# EAGLE design 230v (EAGLE 7.2.0)
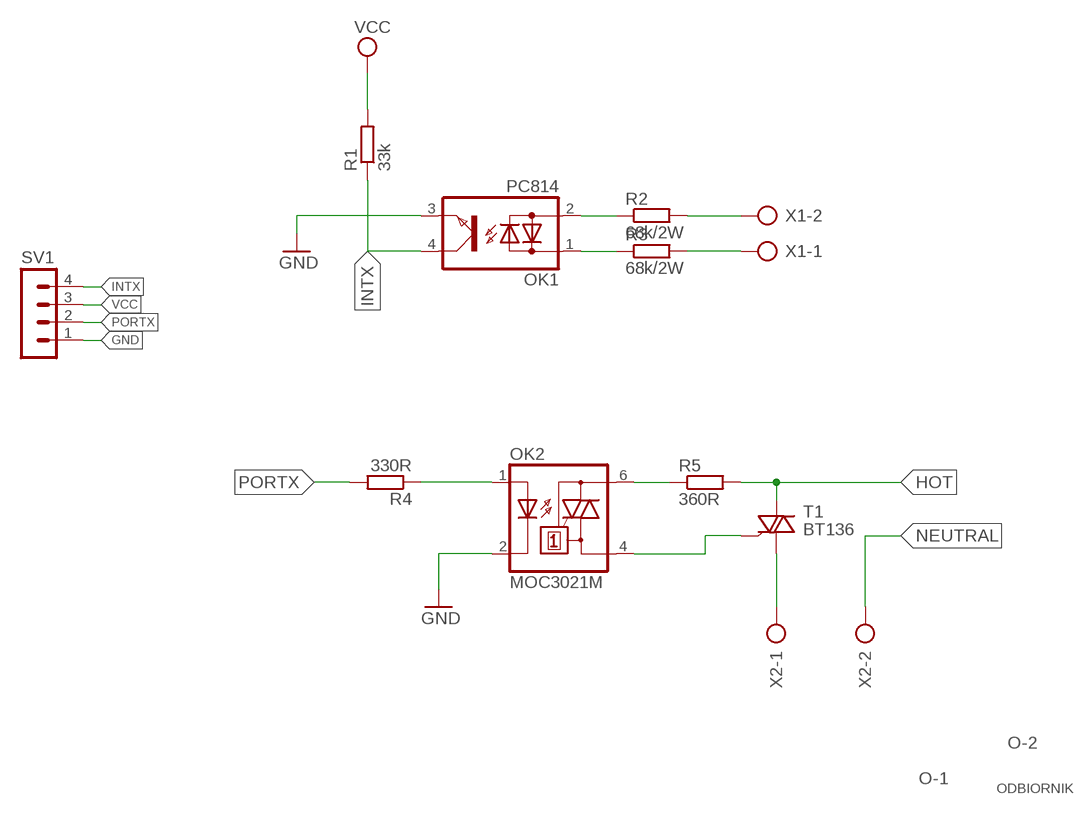
[diagram p0: schematic, sheet 1]

## Parts
OK1  PC814  [DIL04]
OK2  MOC3021M  [DIL06]
R1  33k  R-EU_R0805  [R0805]
R2  68k/2W  R-EU_0309/12  [0309/12]
R3  68k/2W  R-EU_0309/12  [0309/12]
R4  330R  R-EU_R0805  [R0805]
R5  360R  R-EU_0207/7  [0207/7]
SV1  MA04-1  [MA04-1]
T1  BT136  [TO220AB]
X1  AK300/2  [AK300/2]
X2  AK300/2  [AK300/2]

## Nets
GND: OK1.3(E) OK2.2(C) SV1.1
HOT: R2.2 R5.2 T1.2(A2) X1.2
INTX: OK1.4(C) R1.1 SV1.4
N$1: OK1.1(AC1) R3.1
N$2: OK1.2(AC2) R2.1
N$3: OK2.6(A2) R5.1
N$4: OK2.1(A) R4.1
N$5: T1.1(A1) X2.1
N$6: OK2.4(A1) T1.3(G)
NEUTRAL: R3.2 X1.1 X2.2
PORTX: R4.2 SV1.2
VCC: R1.2 SV1.3

## Notes on the sheet
- O-2
- O-1
- ODBIORNIK

## Library data of the parts
OK1 = optocoupler:PC814: SHARP OPTO COUPLER; OC_FARNELL: 9707662; OC_NEWARK: unknown
OK2 = optocoupler:MOC30*M: RANDOM-PHASE OPTOISOLATORS TRIAC DRIVER OUTPUT Source: http://www.fairchildsemi.com MOC3020-M.pdf; MF: FAIRCHILD SEMICONDUCTOR; MPN: MOC3021-M; OC_FARNELL: 1021365; OC_NEWARK: 95B7895
R1-R5 = rcl:R-EU_: RESISTOR, European symbol
SV1 = con-lstb:MA04-1: PIN HEADER; OC_FARNELL: unknown; OC_NEWARK: unknown
T1 = triac:BT136: Triac BT136 series E sensitive gate Source: http://www.nxp.com/acrobat_download/datasheets/BT136_SERIES_E_2.pdf
X1 X2 = con-ptr500:AK300/2: CONNECTOR; OC_FARNELL: unknown; OC_NEWARK: unknown

## Board
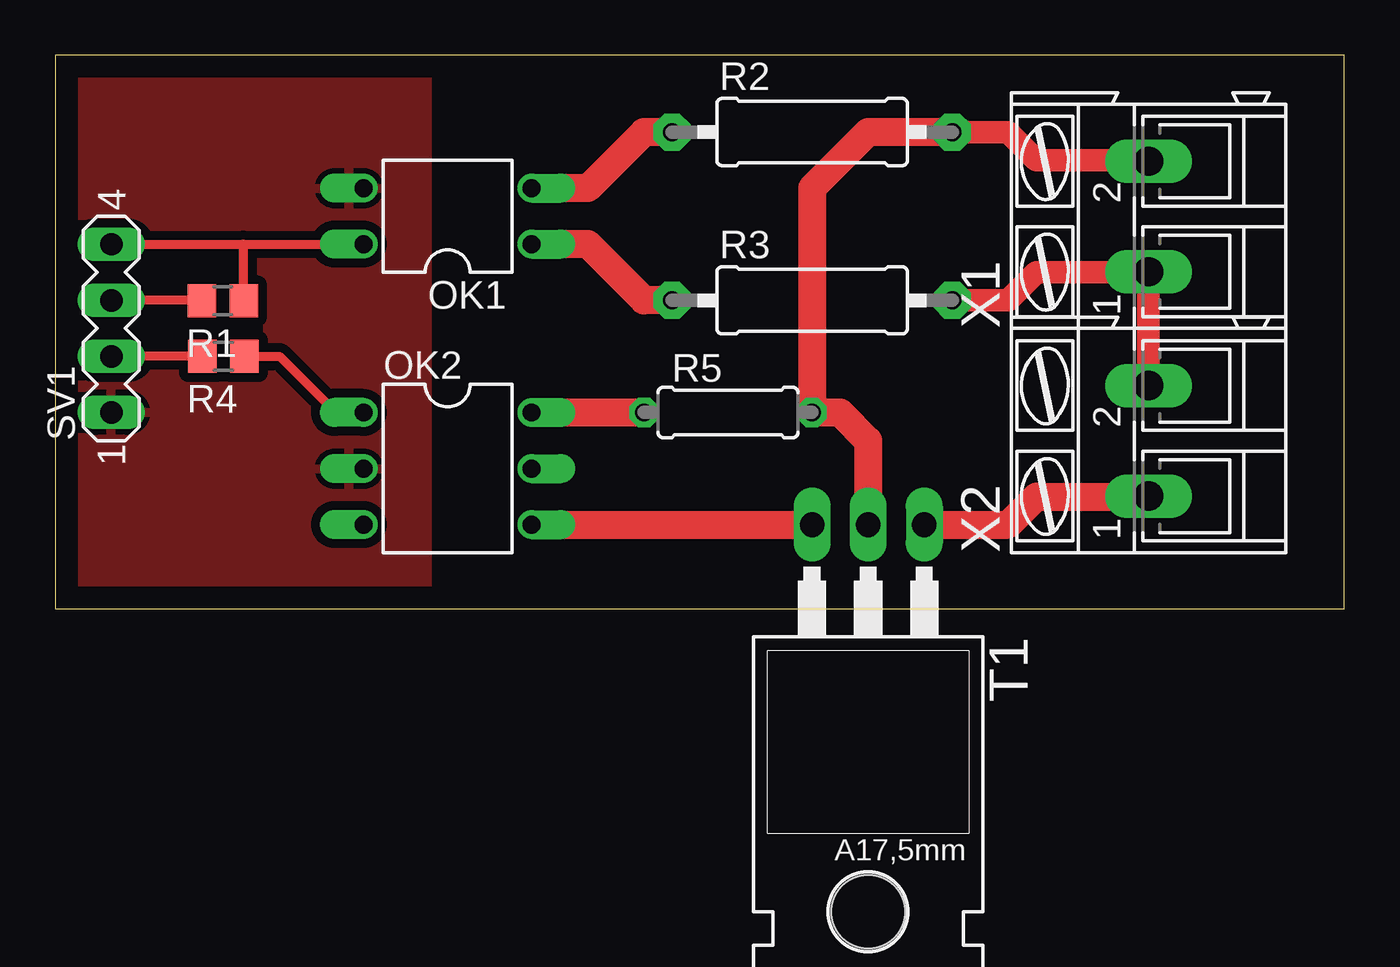
[diagram p1: board, top side]

Size 58.4 x 25.07 mm. Coordinates in mm from the lower left corner, seen from the top.
Outline: 0,0 58.4,0 58.4,25.07 0,25.07 0,0
Copper layers (1*16): Top 0.035mm / dielectric 1.5mm / Bottom 0.035mm
Design rules "default": minimum track width 10mil, minimum drill 24mil, track to track 8mil, track to pad 8mil, pad to pad 8mil, via to via 8mil, smd to smd 8mil, copper to edge 40mil, drill to drill 8mil, minimum pad ring 10mil, minimum via ring 8mil, stop-mask expansion 4mil, vias tented up to drill 0mil, thermal gap 10mil

### Footprints (pad centres in the part's own frame; a part is rotated, then mirrored left to right if it is on the bottom)
DIL04 = drill 0.813 offset: 1 -1.27,-3.81; 2 1.27,-3.81; 3 1.27,3.81; 4 -1.27,3.81
DIL06 = drill 0.813 offset: 1 -2.54,-3.81; 2 0,-3.81; 3 2.54,-3.81; 4 2.54,3.81; 5 0,3.81; 6 -2.54,3.81
R0805 = smd 1.3 x 1.5: 1 -0.95,0; 2 0.95,0
0309/12 = drill 0.813 pad 1.676 octagon: 1 -6.35,0; 2 6.35,0
0207/7 = drill 0.813 octagon: 1 -3.81,0; 2 3.81,0
MA04-1 = drill 1.016 long: 1 -3.81,0; 2 -1.27,0; 3 1.27,0; 4 3.81,0
TO220AB = drill 1.118 long: 1 -2.54,-6.35; 2 0,-6.35; 3 2.54,-6.35 | hole 3.302: 0,11.176
AK300/2 = drill 1.321 long: 1 -2.515,0; 2 2.489,0

### Placement (x,y rotation side)
OK1  17.78,17.78 90 top
OK2  17.78,6.35 270 top
R1  7.59,13.94 180 top
R2  34.29,21.59 0 top
R3  34.29,13.97 0 top
R4  7.62,11.43 180 top
R5  30.48,8.89 0 top
SV1  2.54,12.7 90 top
T1  36.83,-2.54 180 top
X1  49.53,17.78 90 top
X2  49.53,7.62 90 top

### Tracks (layer width: path | path; a pad name or v marks a point on that pad's centre or on a via)
GND
  pour Top (isolate 0.406): 0,26.67 16.84,26.67 16.84,-2.54 0,-2.54
HOT
  Top 1.016: R2.2 43.18,21.59 44.45,20.32 49.48,20.32 X1.2
  Top 1.27: R2.2 36.83,21.59 34.29,19.05 R5.2 35.56,8.89 36.83,7.62 T1.2
INTX
  Top 0.406: SV1.4 8.53,16.51 | 8.53,16.51 OK1.4 | R1.1 8.53,13.95 8.53,16.51
N$1
  Top 1.27: R3.1 26.67,13.97 24.13,16.51 OK1.1
N$2
  Top 1.27: R2.1 26.67,21.59 24.13,19.05 OK1.2
N$3
  Top 1.27: OK2.6 R5.1
N$4
  Top 0.406: OK2.1 12.7,8.89 10.16,11.43 R4.1
N$5
  Top 1.27: T1.1 43.18,3.81 44.45,5.08 49.51,5.08 X2.1
N$6
  Top 1.27: OK2.4 T1.3
NEUTRAL
  Top 1.016: R3.2 43.18,13.97 44.45,15.24 49.51,15.24 X1.1 X2.2
PORTX
  Top 0.406: R4.2 SV1.2
VCC
  Top 0.406: R1.2 6.62,13.97 SV1.3